# Altium schematic sheet [3] - MOTOR-CONTROL.SchDoc
size A
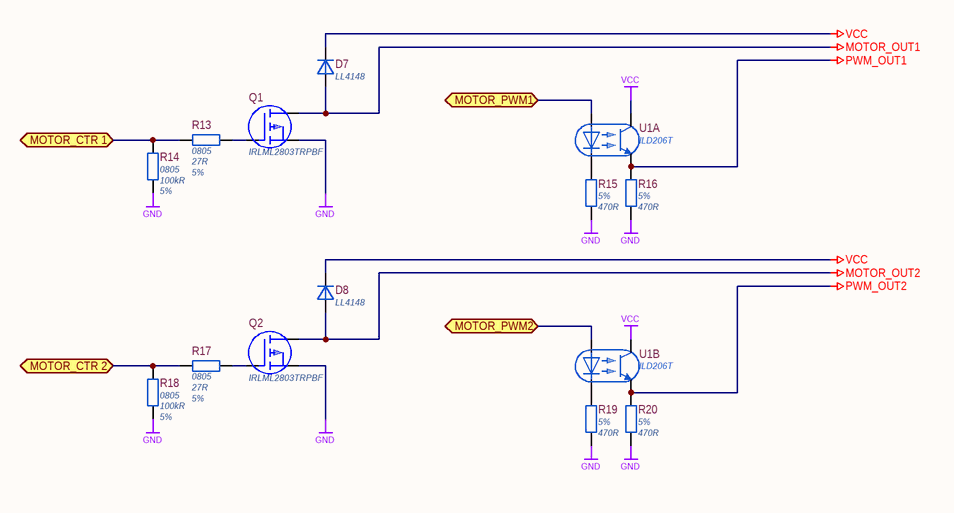
[diagram p0: [3] - MOTOR-CONTROL.SchDoc]

## Parts
D7  LL4148  [SOD-89]
D8  LL4148  [SOD-89]
Q1  IRLML2803TRPBF  [SOT23-3]
Q2  IRLML2803TRPBF  [SOT23-3]
R13  Case Code (Imperial): 0805  Resistance: 27R  Tolerance: 5%  [CH0805R]  (hidden comment: RC0805JR-0727RL)
R14  Case Code (Imperial): 0805  Resistance: 100kR  Tolerance: 5%  [CH0805R]  (hidden comment: RC0805JR-07100KL)
R15  Tolerance: 5%  Resistance: 470R  [CH0805R]  (hidden comment: RC0805JR-07470RL)
R16  Tolerance: 5%  Resistance: 470R  [CH0805R]  (hidden comment: RC0805JR-07470RL)
R17  Case Code (Imperial): 0805  Resistance: 27R  Tolerance: 5%  [CH0805R]  (hidden comment: RC0805JR-0727RL)
R18  Case Code (Imperial): 0805  Resistance: 100kR  Tolerance: 5%  [CH0805R]  (hidden comment: RC0805JR-07100KL)
R19  Tolerance: 5%  Resistance: 470R  [CH0805R]  (hidden comment: RC0805JR-07470RL)
R20  Tolerance: 5%  Resistance: 470R  [CH0805R]  (hidden comment: RC0805JR-07470RL)
U1  ILD206T  [SOIC-8]  (parts A,B of 2)

## Ports
MOTOR_CTR 1 (bidir), MOTOR_CTR 2 (bidir), MOTOR_PWM1 (bidir), MOTOR_PWM2 (bidir)

## Nets
GND: Q1.2(S) Q2.2(S) R14.1 R15.1 R16.1 R18.1 R19.1 R20.1
MOTOR_OUT1: D7.1(A) Q1.3(D)
MOTOR_OUT2: D8.1(A) Q2.3(D)
PWM_OUT1: R16.2 U1.7(E1)
PWM_OUT2: R20.2 U1.5(E2)
VCC: D7.2(K) D8.2(K) U1.6(C2) U1.8(C1)
MOTOR_CTR 1: R13.1 R14.2 ; port MOTOR_CTR 1
MOTOR_CTR 2: R17.1 R18.2 ; port MOTOR_CTR 2
MOTOR_PWM1: U1.1(A1) ; port MOTOR_PWM1
MOTOR_PWM2: U1.3(A2) ; port MOTOR_PWM2
NetQ1_1: Q1.1(G) R13.2
NetQ2_1: Q2.1(G) R17.2
NetR15_2: R15.2 U1.2(K1)
NetR19_2: R19.2 U1.4(K2)

## Library data of the parts
D7 D8 = LL4148: ON SEMICONDUCTOR - LL4148 - DIODE, SMALL SIGNAL, 100V, MINIMELF; Manufacturer 1: ON Semiconductor / Fairchild; Element Configuration: Single; Forward Voltage: 1V; Forward Current: 200mA; Reverse Recovery Time: 4ns; Peak Non-Repetitive Surge Current: 2A; Peak Reverse Current: 25nA; Power Dissipation: 500mW; Supplier 1: Digi-Key; Manufacturer Part Number 1: LL4148; Stock 1: 905673; Pricing 1: 1=0.10000, 10=0.09100, 100=0.04930, 500=0.03036, 1000=0.02070 (USD); RoHS: Yes; Mount: Surface Mount; Number of Pins: 2; Weight: 0.01lb; Contact Plating: Tin; Min Operating Temperature: -65°C; Max Operating Temperature: 175°C; Packaging: Tape and Reel; Max Repetitive Reverse Voltage (Vrrm): 100V; Max Reverse Voltage (DC): 100V; Average Rectified Current: 200mA; Package Quantity: 2500; Max Forward Surge Current (Ifsm): 2A; Max Surge Current: 2A; Recovery Time: 4ns; Voltage: 100V; Reverse Voltage: 100V; Length: 3.6mm; Height: 1.5mm; Width: 1.5mm; Radiation Hardening: No; Lead Free: Lead Free; REACH SVHC: No SVHC; ComponentLink1URL: https://datasheet.ciiva.com/1181/1730036-1181026.pdf?src-supplier=Element14; ComponentLink1Description: https://datasheet.ciiva.com/1181/1730036-1181026.pdf?src-supplier=Element14; ComponentLink2URL: https://datasheet.ciiva.com/8303/ll4148-8303779.pdf?src-supplier=Avnet; ComponentLink2Description: https://datasheet.ciiva.com/8303/ll4148-8303779.pdf?src-supplier=Avnet; ComponentLink3URL: https://datasheet.ciiva.com/27048/94908-27048041.pdf?src-supplier=Jameco; ComponentLink3Description: https://datasheet.ciiva.com/27048/94908-27048041.pdf?src-supplier=Jameco; ComponentLink4URL: https://datasheet.ciiva.com/4453/ll4148-70504-4453114.pdf?src-supplier=Mouser; ComponentLink4Description: https://datasheet.ciiva.com/4453/ll4148-70504-4453114.pdf?src-supplier=Mouser; ComponentLink5URL: https://datasheet.ciiva.com/910/ll4148-910344.pdf?src-supplier=Digi-Key; ComponentLink5Description: https://datasheet.ciiva.com/910/ll4148-910344.pdf?src-supplier=Digi-Key; ComponentLink6URL: https://datasheet.ciiva.com/8053/1896420-8053645.pdf?src-supplier=Element14; ComponentLink6Description: https://datasheet.ciiva.com/8053/1896420-8053645.pdf?src-supplier=Element14; ComponentLink7URL: https://datasheet.ciiva.com/910/ll4148-910343.pdf?src-supplier=Digi-Key; ComponentLink7Description: https://datasheet.ciiva.com/910/ll4148-910343.pdf?src-supplier=Digi-Key; ComponentLink8URL: https://datasheet.ciiva.com/910/ll4148-910345.pdf?src-supplier=Digi-Key; ComponentLink8Description: https://datasheet.ciiva.com/910/ll4148-910345.pdf?src-supplier=Digi-Key; ComponentLink9URL: https://datasheet.ciiva.com/22735/1896420-22735578.pdf?src-supplier=Element14; ComponentLink9Description: https://datasheet.ciiva.com/22735/1896420-22735578.pdf?src-supplier=Element14; ComponentLink10URL: https://datasheet.ciiva.com/26912/getdatasheetpartid-110057-26912779.pdf?src-supplier=Verical; ComponentLink10Description: https://datasheet.ciiva.com/26912/getdatasheetpartid-110057-26912779.pdf?src-supplier=Verical; Supplier Part Number 1: LL4148FSCT-ND
Q1 Q2 = IRLML2803TRPBF: Trans MOSFET N-CH 30V 1.2A 3-Pin SOT-23 T/R; Manufacturer 1: International Rectifier; Gate to Source Voltage (Vgs): 20V; Power Dissipation: 540mW; Turn-On Delay Time: 3.9ns; Turn-Off Delay Time: 9ns; Rise Time: 4ns; Rds On Max: 250mR; Input Capacitance: 85pF; Fall Time: 1.7ns; Number of Elements: 1; Nominal Vgs: 1V; Drain to Source Resistance: 400mR; Element Configuration: Single; Supplier 1: Digi-Key; Manufacturer Part Number 1: IRLML2803TRPBF; Stock 1: 39860; Pricing 1: 1=0.38000, 10=0.30900, 100=0.21030, 500=0.15770, 1000=0.11828 (USD); RoHS: Yes; Mount: Surface Mount; Case/Package: SOT-23; Number of Pins: 3; Min Operating Temperature: -55°C; Max Operating Temperature: 150°C; Continuous Drain Current (ID): 1.2A; Packaging: Tape and Reel; Drain to Source Voltage (Vdss): 30V; Max Power Dissipation: 540mW; Package Quantity: 1; Dual Supply Voltage: 30V; Drain to Source Breakdown Voltage: 30V; On-State Resistance: 250mR; Min Breakdown Voltage: 30V; Termination: SMD/SMT; Threshold Voltage: 1V; Voltage Rating (DC): 30V; Current Rating: 1.2A; Length: 3.04mm; Height: 1.02mm; Width: 1.4mm; Radiation Hardening: No; REACH SVHC: No SVHC; Lead Free: Lead Free; ComponentLink1URL: https://datasheet.ciiva.com/27092/1563665-27092836.pdf?src-supplier=Jameco; ComponentLink1Description: https://datasheet.ciiva.com/27092/1563665-27092836.pdf?src-supplier=Jameco; ComponentLink2URL: https://datasheet.ciiva.com/29326/162828-da-01-en-irlml-2803tr-29326785.pdf?src-supplier=Conrad; ComponentLink2Description: https://datasheet.ciiva.com/29326/162828-da-01-en-irlml-2803tr-29326785.pdf?src-supplier=Conrad; ComponentLink3URL: https://datasheet.ciiva.com/16371/irlml2803pbf-16371749.pdf?src-supplier=Future+Electronics; ComponentLink3Description: https://datasheet.ciiva.com/16371/irlml2803pbf-16371749.pdf?src-supplier=Future+Electronics; ComponentLink4URL: https://datasheet.ciiva.com/6383/irlml2803pbf-6383355.pdf?src-supplier=Digi-Key; ComponentLink4Description: https://datasheet.ciiva.com/6383/irlml2803pbf-6383355.pdf?src-supplier=Digi-Key; ComponentLink5URL: https://datasheet.ciiva.com/5950/irlml2803pbf-5950573.pdf?src-supplier=Farnell; ComponentLink5Description: https://datasheet.ciiva.com/5950/irlml2803pbf-5950573.pdf?src-supplier=Farnell; ComponentLink6URL: https://datasheet.ciiva.com/6383/irlml2803pbf-6383357.pdf?src-supplier=Digi-Key; ComponentLink6Description: https://datasheet.ciiva.com/6383/irlml2803pbf-6383357.pdf?src-supplier=Digi-Key; ComponentLink7URL: https://datasheet.ciiva.com/6383/irlml2803pbf-6383354.pdf?src-supplier=Digi-Key; ComponentLink7Description: https://datasheet.ciiva.com/6383/irlml2803pbf-6383354.pdf?src-supplier=Digi-Key; Supplier Part Number 1: IRLML2803PBFCT-ND
R13 R17 = RC0805JR-0727RL: RES SMD 27 OHM 5% 1/8W 0805; Manufacturer 1: Yageo; Temperature Coefficient: 100ppm/°C; Power Rating: 125mW; Voltage Rating: 150V; Supplier 1: Digi-Key; Manufacturer Part Number 1: RC0805JR-0727RL; Stock 1: 268144; Pricing 1: 1=0.10000, 10=0.03600, 100=0.01460, 1000=0.00654, 2500=0.00568 (USD); RoHS: Yes; Case/Package: 0805; Weight: 0.000194oz; Contact Plating: Tin,Matte,Lead; Case Code (Metric): 2012; Min Operating Temperature: -55°C; Max Operating Temperature: 155°C; Composition: Thick Film; Package Quantity: 1; Packaging: Tape and Reel; Number of Terminations: 2; Termination: SMD/SMT; Military Standard: Not; Max Power Dissipation: 125mW; Features: Moisture Resistant; Length: 2mm; Height: 0.024inch; Width: 0.049inch; Depth: 1.25mm; Radiation Hardening: No; REACH SVHC: Unknown; Lead Free: Lead Free; ComponentLink1URL: https://datasheet.ciiva.com/2456/pyu-r-int-thick-7-2456049.pdf?src-supplier=Digi-Key; ComponentLink1Description: https://datasheet.ciiva.com/2456/pyu-r-int-thick-7-2456049.pdf?src-supplier=Digi-Key; ComponentLink2URL: https://datasheet.ciiva.com/2456/pyu-r-int-thick-7-2456050.pdf?src-supplier=Digi-Key; ComponentLink2Description: https://datasheet.ciiva.com/2456/pyu-r-int-thick-7-2456050.pdf?src-supplier=Digi-Key; ComponentLink3URL: https://datasheet.ciiva.com/2456/pyu-r-int-thick-7-2456051.pdf?src-supplier=Digi-Key; ComponentLink3Description: https://datasheet.ciiva.com/2456/pyu-r-int-thick-7-2456051.pdf?src-supplier=Digi-Key; ComponentLink4URL: https://datasheet.ciiva.com/17050/rc0805-17050396.pdf?src-supplier=Future+Electronics; ComponentLink4Description: https://datasheet.ciiva.com/17050/rc0805-17050396.pdf?src-supplier=Future+Electronics; ComponentLink5URL: https://datasheet.ciiva.com/7941/442941-7941933.pdf?src-supplier=Element14; ComponentLink5Description: https://datasheet.ciiva.com/7941/442941-7941933.pdf?src-supplier=Element14; ComponentLink6URL: https://datasheet.ciiva.com/12577/rc0805-12577759.pdf?src-supplier=Mouser; ComponentLink6Description: https://datasheet.ciiva.com/12577/rc0805-12577759.pdf?src-supplier=Mouser; ComponentLink7URL: https://datasheet.ciiva.com/7941/442941-7941934.pdf?src-supplier=Element14; ComponentLink7Description: https://datasheet.ciiva.com/7941/442941-7941934.pdf?src-supplier=Element14; Supplier Part Number 1: 311-27ARCT-ND
R14 R18 = RC0805JR-07100KL: RES SMD 100K OHM 5% 1/8W 0805; Manufacturer 1: Yageo; Temperature Coefficient: 100ppm/°C; Power Rating: 125mW; Voltage Rating: 150V; Supplier 1: Digi-Key; Manufacturer Part Number 1: RC0805JR-07100KL; Stock 1: 4415203; Pricing 1: 1=0.10000, 10=0.03600, 100=0.01460, 1000=0.00654, 2500=0.00568 (USD); RoHS: Yes; Case/Package: 0805; Contact Plating: Tin,Matte,Lead; Case Code (Metric): 2012; Min Operating Temperature: -55°C; Max Operating Temperature: 155°C; Composition: Thick Film; Packaging: Tape and Reel; Termination: SMD/SMT; Military Standard: Not; Length: 2mm; Depth: 1.25mm; Radiation Hardening: No; REACH SVHC: Unknown; Lead Free: Lead Free; ComponentLink1URL: https://datasheet.ciiva.com/7941/442941-7941864.pdf?src-supplier=Element14; ComponentLink1Description: https://datasheet.ciiva.com/7941/442941-7941864.pdf?src-supplier=Element14; ComponentLink2URL: https://datasheet.ciiva.com/7941/442941-7941865.pdf?src-supplier=Element14; ComponentLink2Description: https://datasheet.ciiva.com/7941/442941-7941865.pdf?src-supplier=Element14; ComponentLink3URL: https://datasheet.ciiva.com/15190/getdatasheetpartid-479267-15190029.pdf?src-supplier=Verical; ComponentLink3Description: https://datasheet.ciiva.com/15190/getdatasheetpartid-479267-15190029.pdf?src-supplier=Verical; Supplier Part Number 1: 311-100KARCT-ND
R15 R16 R19 R20 = RC0805JR-07470RL: RES SMD 470 OHM 5% 1/8W 0805; Manufacturer 1: Yageo; Power Rating: 125mW; Temperature Coefficient: 100ppm/°C; Voltage Rating: 150V; Supplier 1: Digi-Key; Manufacturer Part Number 1: RC0805JR-07470RL; Stock 1: 1884733; Pricing 1: 1=0.10000, 10=0.03600, 100=0.01460, 1000=0.00654, 2500=0.00568 (USD); RoHS: Yes; Case/Package: 0805; Contact Plating: Tin,Matte,Lead; Case Code (Imperial): 0805; Case Code (Metric): 2012; Min Operating Temperature: -55°C; Max Operating Temperature: 155°C; Packaging: Tape and Reel; Composition: Thick Film; Termination: SMD/SMT; Military Standard: Not; Length: 2mm; Depth: 1.25mm; Radiation Hardening: No; REACH SVHC: Unknown; Lead Free: Lead Free; ComponentLink1URL: https://datasheet.ciiva.com/2456/rc080520pb20free-2456048.pdf?src-supplier=Digi-Key; ComponentLink1Description: https://datasheet.ciiva.com/2456/rc080520pb20free-2456048.pdf?src-supplier=Digi-Key; ComponentLink2URL: https://datasheet.ciiva.com/15190/getdatasheetpartid-330937-15190054.pdf?src-supplier=Verical; ComponentLink2Description: https://datasheet.ciiva.com/15190/getdatasheetpartid-330937-15190054.pdf?src-supplier=Verical; ComponentLink3URL: https://datasheet.ciiva.com/12667/rc0805-12667416.pdf?src-supplier=Mouser; ComponentLink3Description: https://datasheet.ciiva.com/12667/rc0805-12667416.pdf?src-supplier=Mouser; ComponentLink4URL: https://datasheet.ciiva.com/16740/rc0805-16740745.pdf?src-supplier=Future+Electronics; ComponentLink4Description: https://datasheet.ciiva.com/16740/rc0805-16740745.pdf?src-supplier=Future+Electronics; ComponentLink5URL: https://datasheet.ciiva.com/7941/442941-7941965.pdf?src-supplier=Element14; ComponentLink5Description: https://datasheet.ciiva.com/7941/442941-7941965.pdf?src-supplier=Element14; ComponentLink6URL: https://datasheet.ciiva.com/7941/442941-7941966.pdf?src-supplier=Element14; ComponentLink6Description: https://datasheet.ciiva.com/7941/442941-7941966.pdf?src-supplier=Element14; ComponentLink7URL: https://datasheet.ciiva.com/46395/444164-46395134.pdf?src-supplier=Element14; ComponentLink7Description: https://datasheet.ciiva.com/46395/444164-46395134.pdf?src-supplier=Element14; Supplier Part Number 1: 311-470ARCT-ND
U1 = ILD206T: OPTOISOLTR 4KV 2CH TRANS 8-SOIC; Manufacturer 1: Vishay Semiconductors; Max Power Dissipation: 300mW; Forward Current: 30mA; Number of Channels: 2; Collector Emitter Voltage (VCEO): 70V; Reverse Breakdown Voltage: 6V; Forward Voltage: 1.55V; Collector Emitter Saturation Voltage: 400mV; Rise Time: 3us; Fall Time: 4.7us; Current Transfer Ratio: 125%; Input Current: 10mA; Voltage Rating (DC): 5V; Approvals: UL; Supplier 1: Digi-Key; Manufacturer Part Number 1: ILD206T; Stock 1: 1775; Pricing 1: 1=1.42000, 10=1.15000, 100=0.70770, 500=0.60154, 1000=0.49539 (USD); RoHS: Yes; Mount: Surface Mount; Case/Package: SOIC; Number of Pins: 8; Contact Plating: Tin; Min Operating Temperature: -55°C; Max Operating Temperature: 100°C; Packaging: Tape and Reel; Package Quantity: 1; Output Voltage: 70V; Max Output Voltage: 70V; Isolation Voltage: 4kV; Max Input Current: 30mA; Number of Elements: 2; Power Dissipation: 300mW; Collector Emitter Breakdown Voltage: 70V; Radiation Hardening: No; REACH SVHC: Unknown; Lead Free: Lead Free; ComponentLink1URL: https://datasheet.ciiva.com/8040/6546-8040800.pdf?src-supplier=Element14; ComponentLink1Description: https://datasheet.ciiva.com/8040/6546-8040800.pdf?src-supplier=Element14; ComponentLink2URL: https://datasheet.ciiva.com/15118/getdatasheetpartid-90557-15118533.pdf?src-supplier=Verical; ComponentLink2Description: https://datasheet.ciiva.com/15118/getdatasheetpartid-90557-15118533.pdf?src-supplier=Verical; ComponentLink3URL: https://datasheet.ciiva.com/11771/0900766b80800ea7-11771944.pdf?src-supplier=RSComponents; ComponentLink3Description: https://datasheet.ciiva.com/11771/0900766b80800ea7-11771944.pdf?src-supplier=RSComponents; ComponentLink4URL: https://datasheet.ciiva.com/14169/wr630131-630134-e-14169304.pdf?src-supplier=Distrelec; ComponentLink4Description: https://datasheet.ciiva.com/14169/wr630131-630134-e-14169304.pdf?src-supplier=Distrelec; ComponentLink5URL: https://datasheet.ciiva.com/29301/153399-da-01-en-optokoppler-ild206-t-soic8-vis-29301383.pdf?src-supplier=Conrad; ComponentLink5Description: https://datasheet.ciiva.com/29301/153399-da-01-en-optokoppler-ild206-t-soic8-vis-29301383.pdf?src-supplier=Conrad; ComponentLink6URL: https://datasheet.ciiva.com/18445/70061477-18445110.pdf?src-supplier=Allied+Electronics; ComponentLink6Description: https://datasheet.ciiva.com/18445/70061477-18445110.pdf?src-supplier=Allied+Electronics; ComponentLink7URL: https://datasheet.ciiva.com/12242/ild205t-244792-12242999.pdf?src-supplier=Mouser; ComponentLink7Description: https://datasheet.ciiva.com/12242/ild205t-244792-12242999.pdf?src-supplier=Mouser; ComponentLink8URL: https://datasheet.ciiva.com/2086/ild205t-2086025.pdf?src-supplier=Digi-Key; ComponentLink8Description: https://datasheet.ciiva.com/2086/ild205t-2086025.pdf?src-supplier=Digi-Key; ComponentLink9URL: https://datasheet.ciiva.com/2086/ild205t-2086026.pdf?src-supplier=Digi-Key; ComponentLink9Description: https://datasheet.ciiva.com/2086/ild205t-2086026.pdf?src-supplier=Digi-Key; ComponentLink10URL: https://datasheet.ciiva.com/2086/ild205t-2086027.pdf?src-supplier=Digi-Key; ComponentLink10Description: https://datasheet.ciiva.com/2086/ild205t-2086027.pdf?src-supplier=Digi-Key; ComponentLink11URL: https://datasheet.ciiva.com/3305/ild205t-3305918.pdf?src-supplier=Avnet; ComponentLink11Description: https://datasheet.ciiva.com/3305/ild205t-3305918.pdf?src-supplier=Avnet; ComponentLink12URL: https://datasheet.ciiva.com/26321/485037-26321070.pdf?src-supplier=Element14; ComponentLink12Description: https://datasheet.ciiva.com/26321/485037-26321070.pdf?src-supplier=Element14; Supplier Part Number 1: 751-1309-1-ND